# Altium project MaiChe.PrjPcb
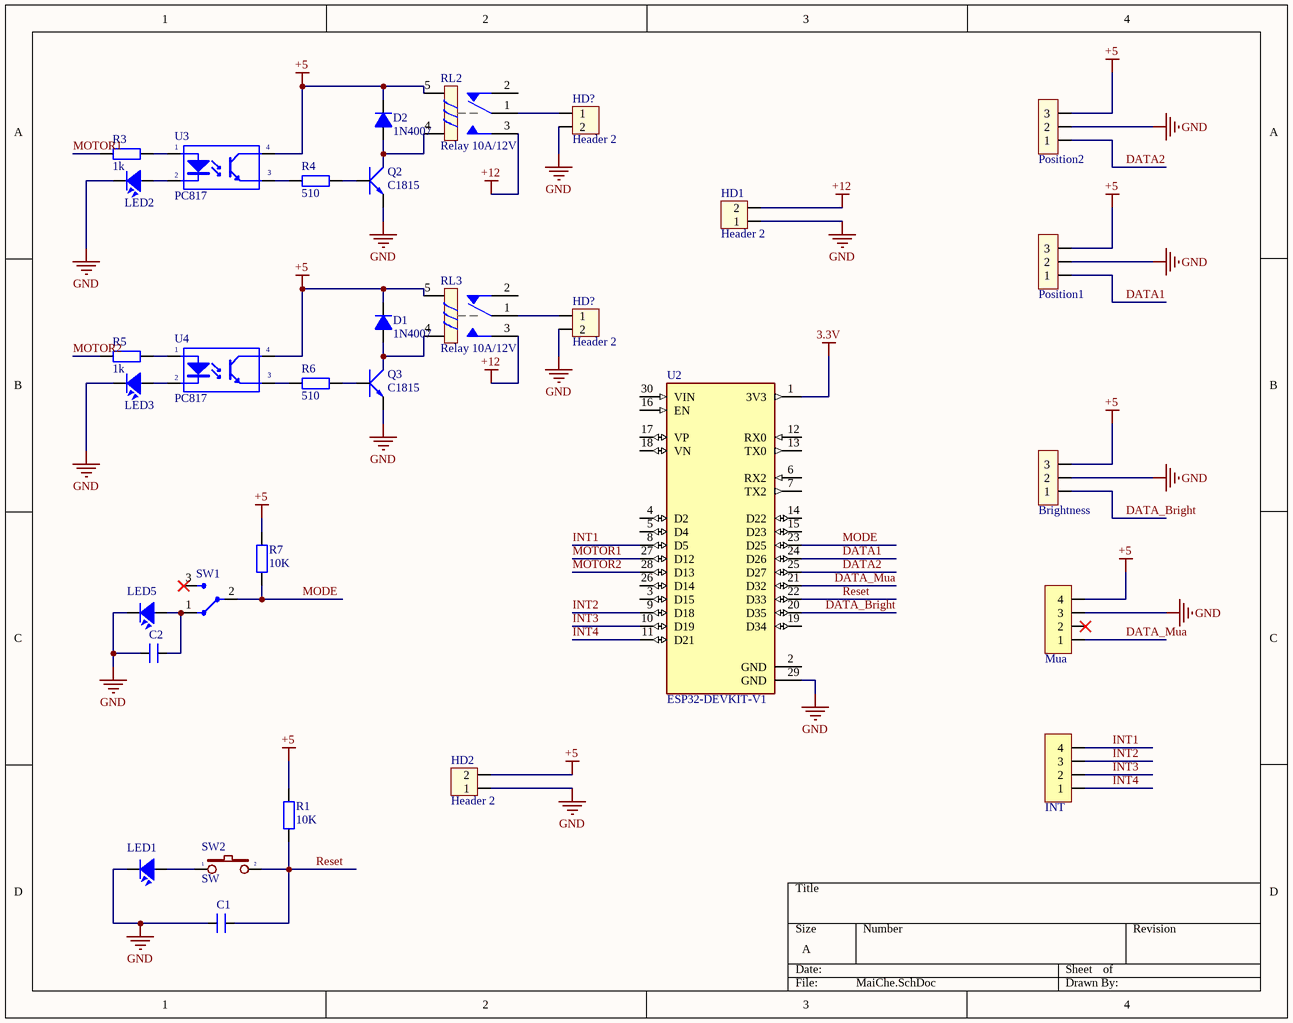
[diagram p0: MaiChe.SchDoc]
1 sheet, 32 parts. Net scope: global (net labels, ports and power ports of the same name join across sheets).
Board file: MaiChe.PcbDoc

## Sheet MaiChe.SchDoc
size A; SheetNumber: 1; SheetTotal: 1

### Parts
(Parts that share a designator on the sheet are numbered #1, #2 ... from top to bottom, then left to right.)
Brightness  Jumper 3  [JP3]  (value not drawn)
C1  100pF  [CN1]  (value not drawn)
C2  100pF  [CN1]  (value not drawn)
D1  1N4007  [D1A]
D2  1N4007  [D1A]
HD1  Header 2  [HED2]
HD2  Header 2  [HED2]
HD?#1  Header 2  [HED2]
HD?#2  Header 2  [HED2]
INT  JP 1x4 2.54  [JP 1x4 CC]  (value not drawn)
LED1  LED  [LED-3MM-YELLOW]  (value not drawn)
LED2  LED  [LED-3MM-YELLOW]  (value not drawn)
LED3  LED  [LED-3MM-YELLOW]  (value not drawn)
LED5  LED  [LED-3MM-YELLOW]  (value not drawn)
Mua  JP 1x4 2.54  [JP 1x4 CC]  (value not drawn)
Position1  Jumper 3  [JP3]  (value not drawn)
Position2  Jumper 3  [JP3]  (value not drawn)
Q2  C1815  [QTO-92]
Q3  C1815  [QTO-92]
R1  10K  [R1/4W]
R3  1k  [R1/4W]
R4  510  [R1/4W]
R5  1k  [R1/4W]
R6  510  [R1/4W]
R7  10K  [R1/4W]
RL2  Relay 10A/12V  [RL_SPDT_10A]
RL3  Relay 10A/12V  [RL_SPDT_10A]
SW1  Switch 3x1  [SW3x1]  (value not drawn)
SW2  SW  [SW2]
U2  ESP32-DEVKIT-V1  [MODULE_ESP32_DEVKIT_V1]
U3  PC817  [DIP4/W0.3]
U4  PC817  [DIP4/W0.3]

### Nets
3.3V: U2.1(3V3)
+5: Brightness.3 D1.2(K) D2.2(K) HD2.2 Mua.4 Position1.3 Position2.3 R1.1 R7.1 RL2.5 RL3.5 U3.4(C) U4.4(C)
+12: HD1.2 RL2.3 RL3.3
GND: Brightness.2 C1.1 C2.1 HD1.1 HD2.1 HD?#1.2 HD?#2.2 LED1.2 LED2.2 LED3.2 LED5.2 Mua.3 Position1.2 Position2.2 Q2.1(E) Q3.1(E) U2.29(GND)
DATA1: Position1.1 U2.24(D26)
DATA2: Position2.1 U2.25(D27)
DATA_Bright: Brightness.1 U2.20(D35)
DATA_Mua: Mua.1 U2.21(D32)
INT1: INT.4 U2.8(D5)
INT2: INT.3 U2.9(D18)
INT3: INT.2 U2.10(D19)
INT4: INT.1 U2.11(D21)
MODE: R7.2 SW1.2 U2.23(D25)
MOTOR1: R3.2 U2.27(D12)
MOTOR2: R5.2 U2.28(D13)
Reset: C1.2 R1.2 SW2.2 U2.22(D33)
NetC2_2: C2.2 LED5.1 SW1.1
NetD1_1: D1.1(A) Q3.2(C) RL3.4
NetD2_1: D2.1(A) Q2.2(C) RL2.4
NetHD?#1_1: HD?#1.1 RL2.1
NetHD?#2_1: HD?#2.1 RL3.1
NetLED1_1: LED1.1 SW2.1
NetLED2_1: LED2.1 U3.2(K)
NetLED3_1: LED3.1 U4.2(K)
NetQ2_3: Q2.3(B) R4.1
NetQ3_3: Q3.3(B) R6.1
NetR3_1: R3.1 U3.1(A)
NetR4_2: R4.2 U3.3(E)
NetR5_1: R5.1 U4.1(A)
NetR6_2: R6.2 U4.3(E)

Not connected (* = marked no-connect by the designer): Mua 2*; RL2 2; RL3 2; SW1 3(I/O2)*; U2 2(GND) 3(D15) 4(D2) 5(D4) 6(RX2) 7(TX2) 12(RX0) 13(TX0) 14(D22) 15(D23) 16(EN) 17(VP) 18(VN) 19(D34) 26(D14) 30(VIN)

### Library data of the parts
Brightness Position1 Position2 = JP3: Value: J3
C1 C2 = CN1: Cap np  1pF - 472pF; Value: 100pF
D1 D2 = D1A: Diode 1A; Value: 1N4007
HD1 HD2 HD?#1 HD?#2 = Hed2: Header 2 (Green); Value: Header 2
INT Mua = JP 1x4 2.54 Cai Cong: Cắm; Ten_Linh_Kien: Jump Đơn Cái 2.54MM 1x40P Cong; Don_Vi: Con; Ma_Hang: MH001265; Ghi_Chu: *; Kieu_Chan: *; Chung_Loai: Cắm
LED1-LED3 LED5 = LED: LED Single colour Green and Red; Value: LED 3 ly Single Colour
Q2 Q3 = C1815: NPN 600mW, ECB; Value: C1815
R1 R3-R7 = R1/4W: Resistor 1/4W; Value: R1/4W - 1K
RL2 RL3 = Relay 1: Relay SPDT,10A - 12VDC 5 Pin; Value: Relay SPDT, 10A, 12V
SW1 = SW3x1: Value: Switch 4x2
SW2 = SW2: Switch button 2 pin; Value: SW chip 2 pin
U2 = ESP32-DEVKIT-V1: Dual core, Wi-Fi: 2.4 GHz up to 150 Mbits/s,BLE (Bluetooth Low Energy) and legacy Bluetooth, 32 bits, Up to 240 MHz; MF: Do it; Value: *; MP: ESP32-DEVKIT-V1; SnapEDA_Link: https://www.snapeda.com/parts/ESP32-DEVKIT-V1/Do+it/view-part/?ref=snap; Price: None; Package: None; Check_prices: https://www.snapeda.com/parts/ESP32-DEVKIT-V1/Do+it/view-part/?ref=eda; Availability: Not in stock
U3 U4 = PC817: Single Opto; Value: PC817